# EAGLE schematic schematic (EAGLE 6.6.0)

## Sheet 1 of 5: LEDs Schematic with all the LEDs (Type: WS2812B). There are two seperated data circuits DATA_In_1 and DATA_IN_2 which both have 30 LEDs series-connected.
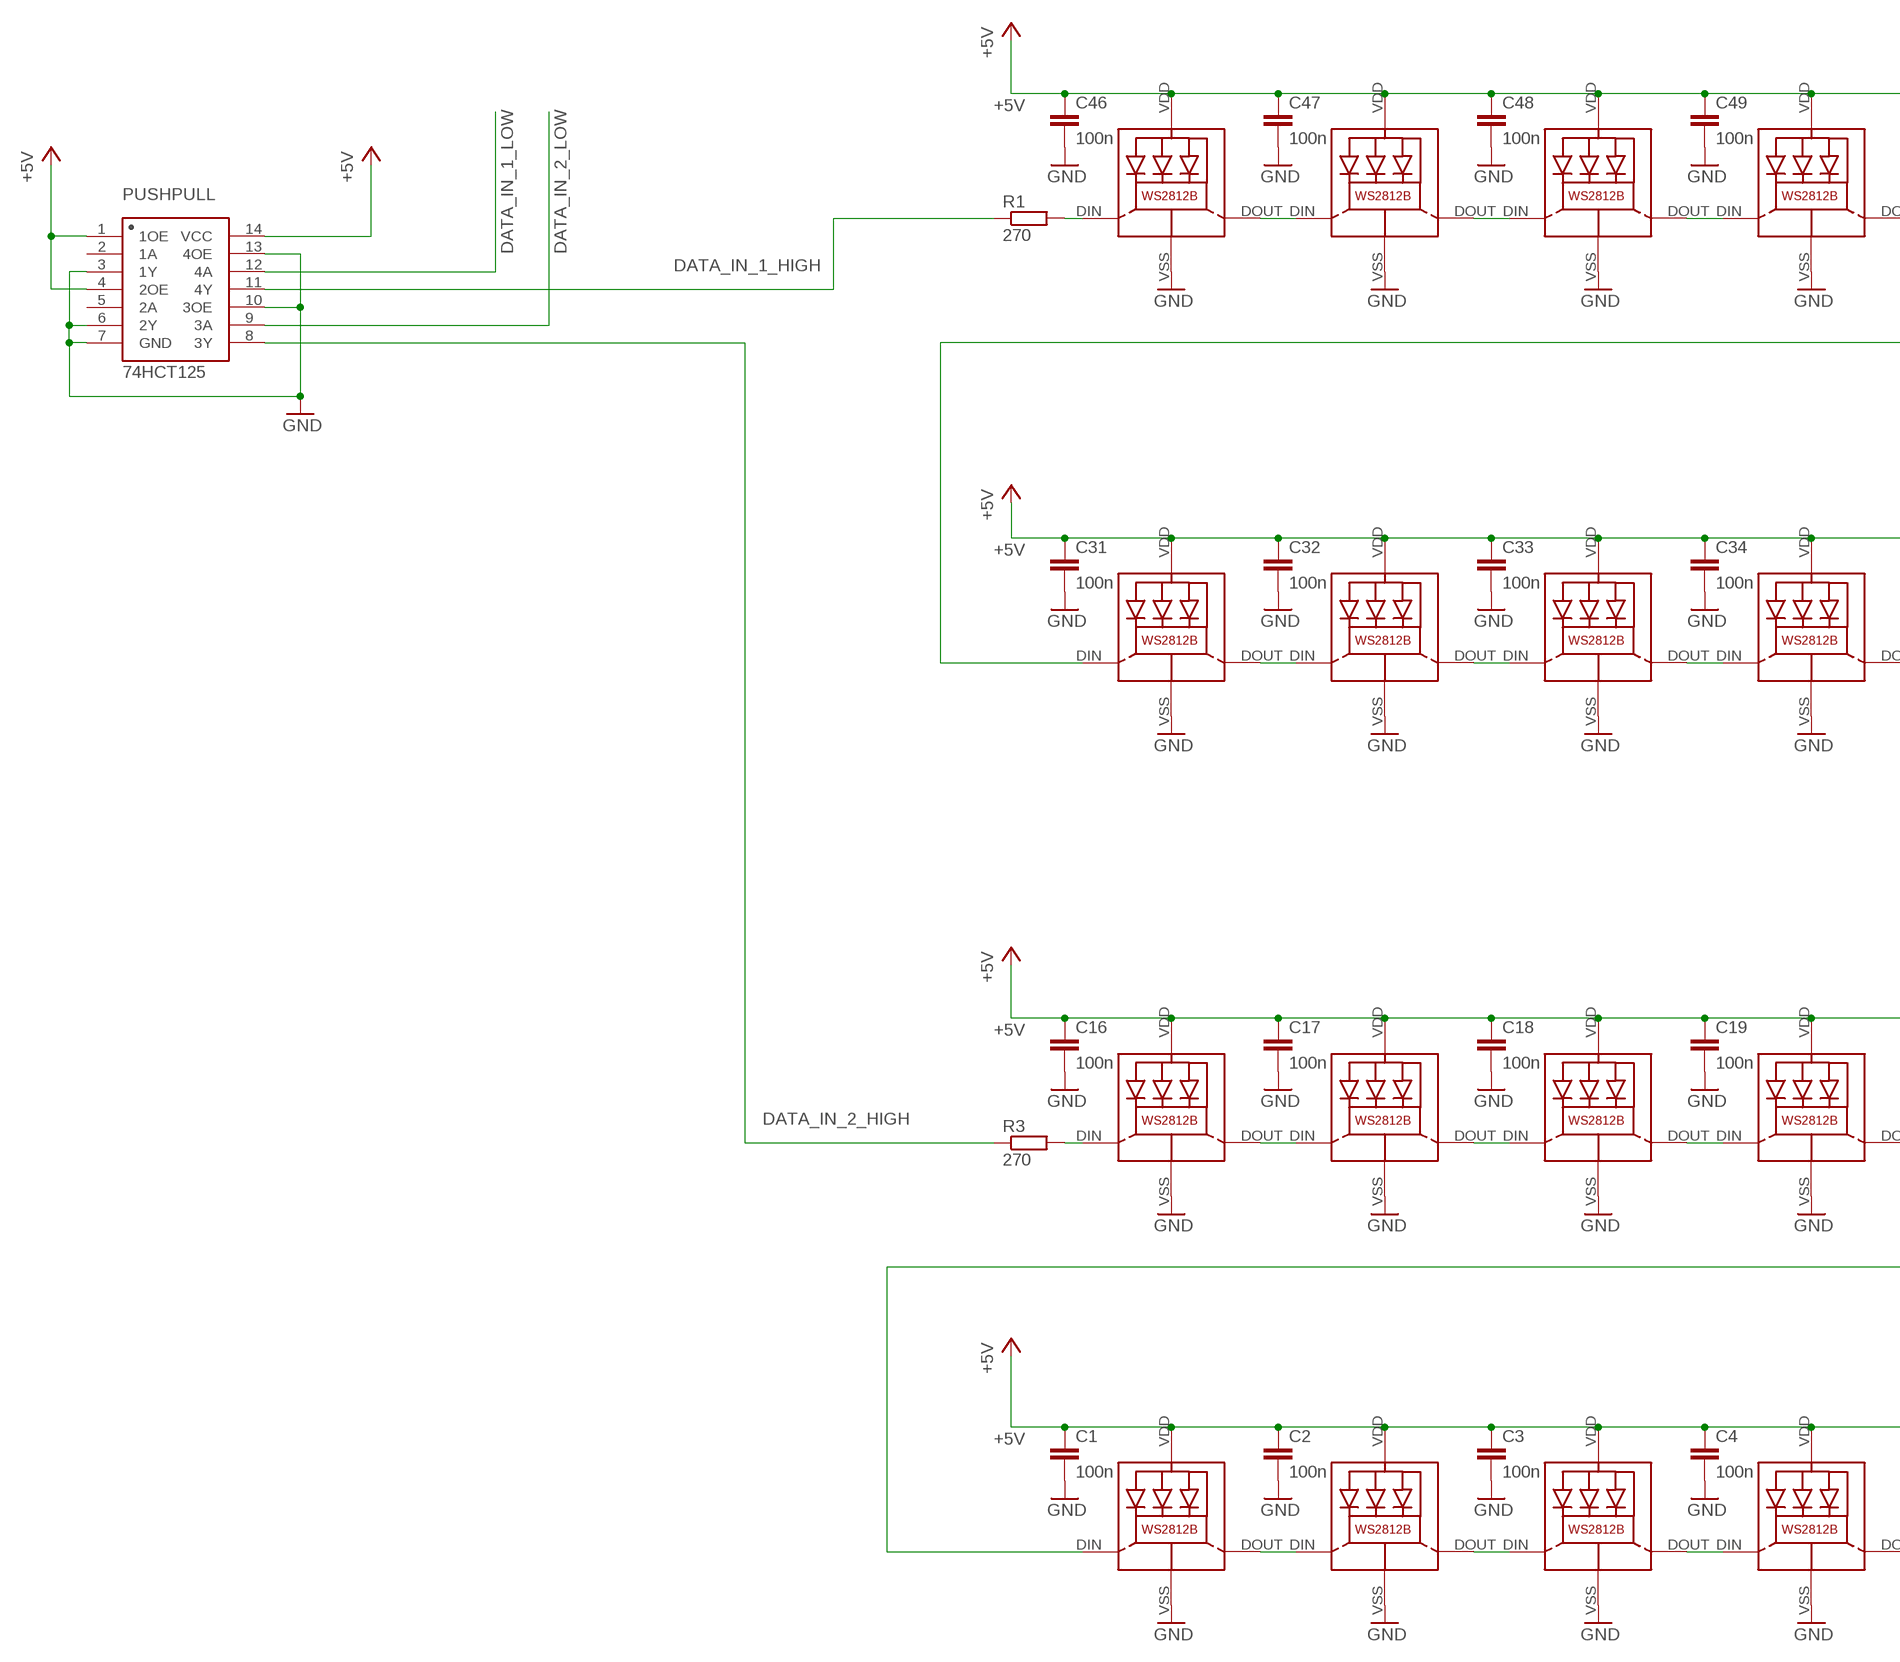
[diagram p0: schematic, sheet 1, part 1 of 2]
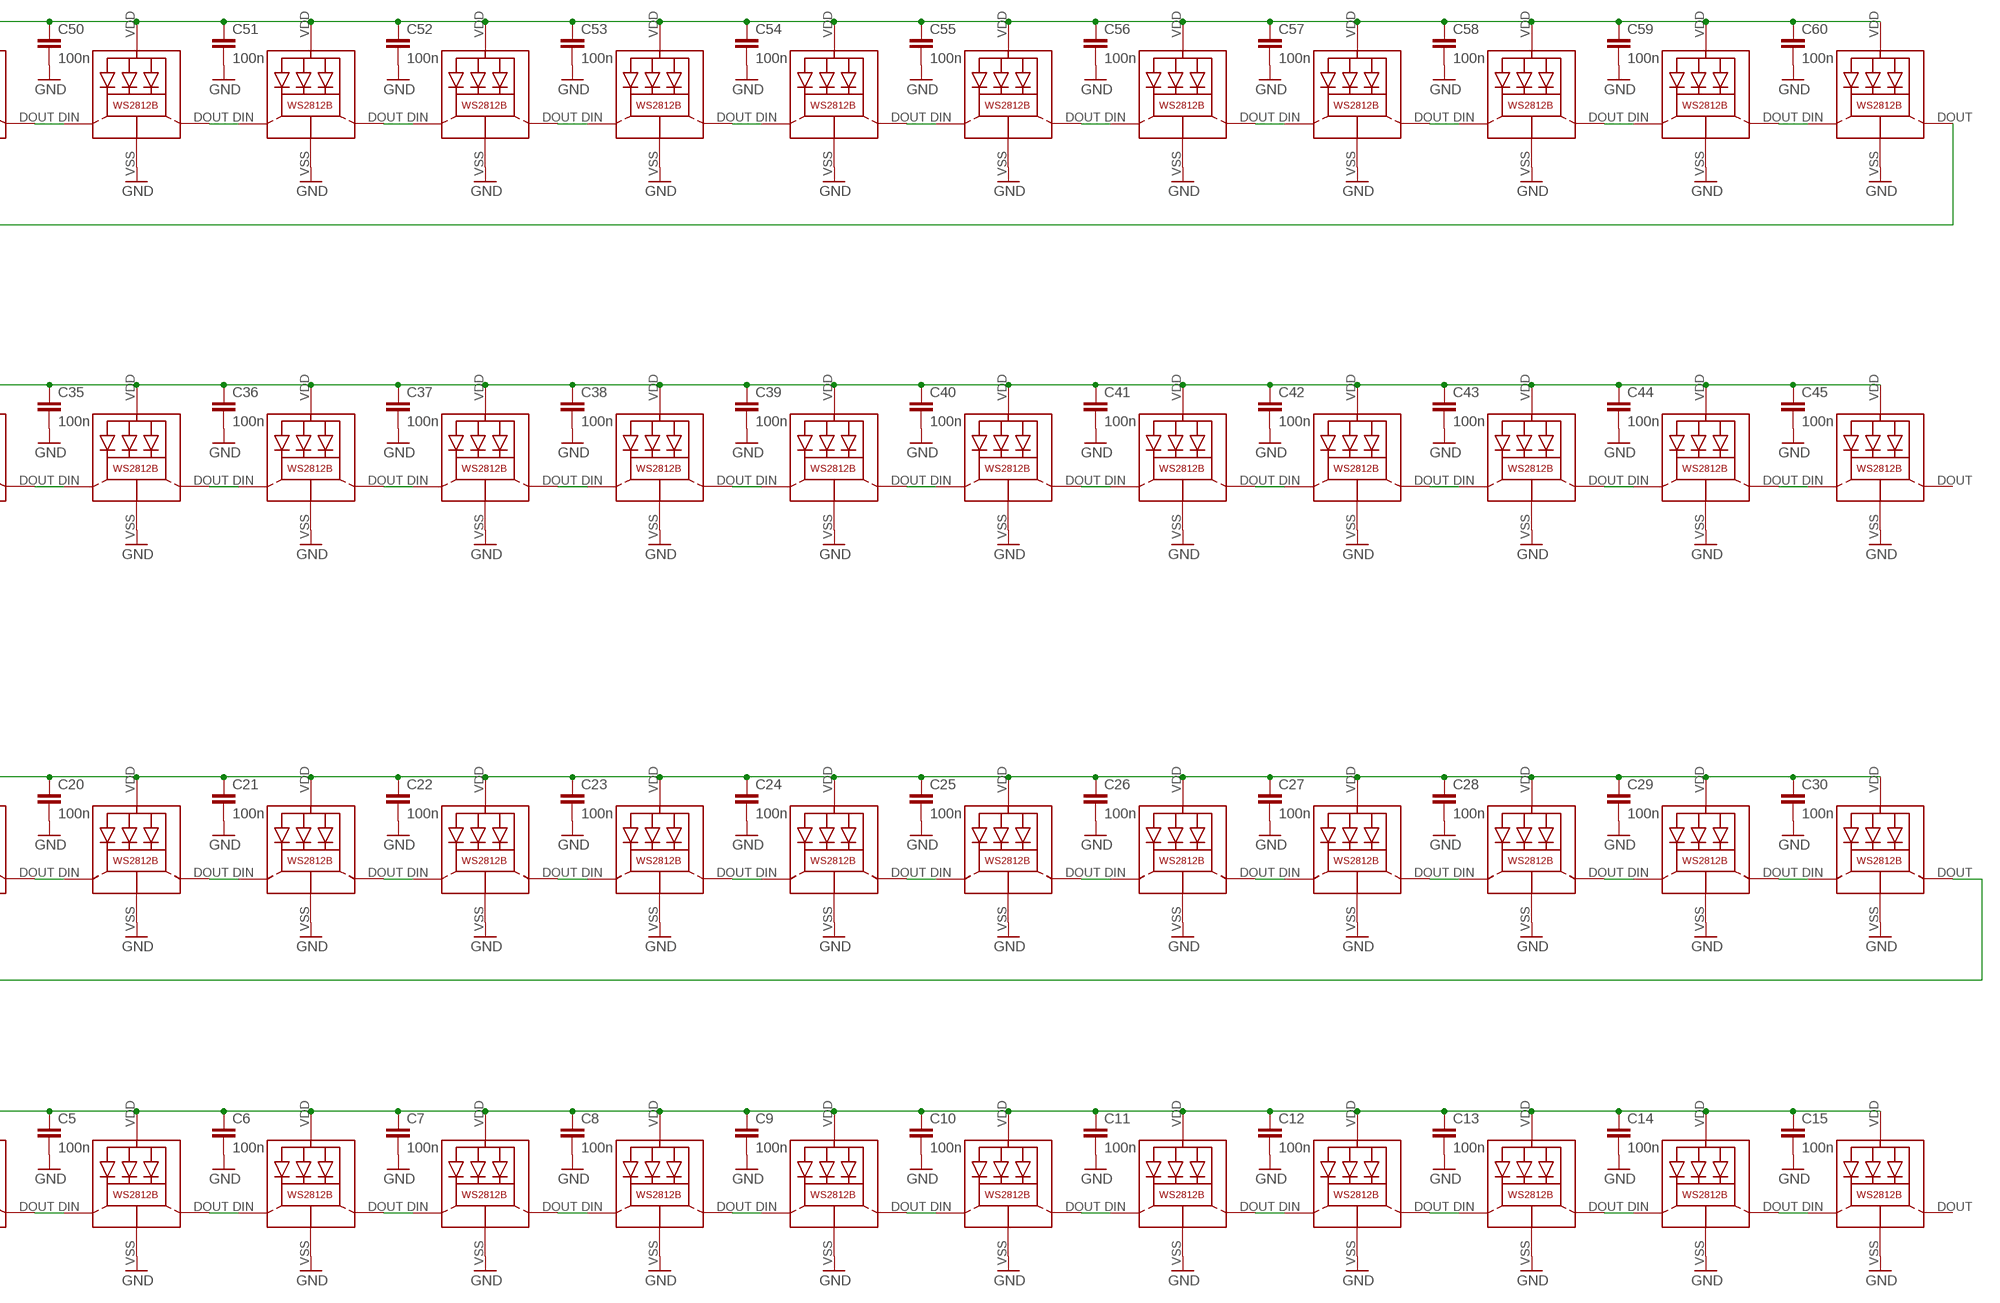
[diagram p1: schematic, sheet 1, part 2 of 2]

### Parts
C1  100n  C-EUC0805  [C0805]
C2  100n  C-EUC0805  [C0805]
C3  100n  C-EUC0805  [C0805]
C4  100n  C-EUC0805  [C0805]
C5  100n  C-EUC0805  [C0805]
C6  100n  C-EUC0805  [C0805]
C7  100n  C-EUC0805  [C0805]
C8  100n  C-EUC0805  [C0805]
C9  100n  C-EUC0805  [C0805]
C10  100n  C-EUC0805  [C0805]
C11  100n  C-EUC0805  [C0805]
C12  100n  C-EUC0805  [C0805]
C13  100n  C-EUC0805  [C0805]
C14  100n  C-EUC0805  [C0805]
C15  100n  C-EUC0805  [C0805]
C16  100n  C-EUC0805  [C0805]
C17  100n  C-EUC0805  [C0805]
C18  100n  C-EUC0805  [C0805]
C19  100n  C-EUC0805  [C0805]
C20  100n  C-EUC0805  [C0805]
C21  100n  C-EUC0805  [C0805]
C22  100n  C-EUC0805  [C0805]
C23  100n  C-EUC0805  [C0805]
C24  100n  C-EUC0805  [C0805]
C25  100n  C-EUC0805  [C0805]
C26  100n  C-EUC0805  [C0805]
C27  100n  C-EUC0805  [C0805]
C28  100n  C-EUC0805  [C0805]
C29  100n  C-EUC0805  [C0805]
C30  100n  C-EUC0805  [C0805]
C31  100n  C-EUC0805  [C0805]
C32  100n  C-EUC0805  [C0805]
C33  100n  C-EUC0805  [C0805]
C34  100n  C-EUC0805  [C0805]
C35  100n  C-EUC0805  [C0805]
C36  100n  C-EUC0805  [C0805]
C37  100n  C-EUC0805  [C0805]
C38  100n  C-EUC0805  [C0805]
C39  100n  C-EUC0805  [C0805]
C40  100n  C-EUC0805  [C0805]
C41  100n  C-EUC0805  [C0805]
C42  100n  C-EUC0805  [C0805]
C43  100n  C-EUC0805  [C0805]
C44  100n  C-EUC0805  [C0805]
C45  100n  C-EUC0805  [C0805]
C46  100n  C-EUC0805  [C0805]
C47  100n  C-EUC0805  [C0805]
C48  100n  C-EUC0805  [C0805]
C49  100n  C-EUC0805  [C0805]
C50  100n  C-EUC0805  [C0805]
C51  100n  C-EUC0805  [C0805]
C52  100n  C-EUC0805  [C0805]
C53  100n  C-EUC0805  [C0805]
C54  100n  C-EUC0805  [C0805]
C55  100n  C-EUC0805  [C0805]
C56  100n  C-EUC0805  [C0805]
C57  100n  C-EUC0805  [C0805]
C58  100n  C-EUC0805  [C0805]
C59  100n  C-EUC0805  [C0805]
C60  100n  C-EUC0805  [C0805]
LED1  WS2812B  [WS2812B]
LED2  WS2812B  [WS2812B]
LED3  WS2812B  [WS2812B]
LED4  WS2812B  [WS2812B]
LED5  WS2812B  [WS2812B]
LED6  WS2812B  [WS2812B]
LED7  WS2812B  [WS2812B]
LED8  WS2812B  [WS2812B]
LED9  WS2812B  [WS2812B]
LED10  WS2812B  [WS2812B]
LED11  WS2812B  [WS2812B]
LED12  WS2812B  [WS2812B]
LED13  WS2812B  [WS2812B]
LED14  WS2812B  [WS2812B]
LED15  WS2812B  [WS2812B]
LED16  WS2812B  [WS2812B]
LED17  WS2812B  [WS2812B]
LED18  WS2812B  [WS2812B]
LED19  WS2812B  [WS2812B]
LED20  WS2812B  [WS2812B]
LED21  WS2812B  [WS2812B]
LED22  WS2812B  [WS2812B]
LED23  WS2812B  [WS2812B]
LED24  WS2812B  [WS2812B]
LED25  WS2812B  [WS2812B]
LED26  WS2812B  [WS2812B]
LED27  WS2812B  [WS2812B]
LED28  WS2812B  [WS2812B]
LED29  WS2812B  [WS2812B]
LED30  WS2812B  [WS2812B]
LED31  WS2812B  [WS2812B]
LED32  WS2812B  [WS2812B]
LED33  WS2812B  [WS2812B]
LED34  WS2812B  [WS2812B]
LED35  WS2812B  [WS2812B]
LED36  WS2812B  [WS2812B]
LED37  WS2812B  [WS2812B]
LED38  WS2812B  [WS2812B]
LED39  WS2812B  [WS2812B]
LED40  WS2812B  [WS2812B]
LED41  WS2812B  [WS2812B]
LED42  WS2812B  [WS2812B]
LED43  WS2812B  [WS2812B]
LED44  WS2812B  [WS2812B]
LED45  WS2812B  [WS2812B]
LED46  WS2812B  [WS2812B]
LED47  WS2812B  [WS2812B]
LED48  WS2812B  [WS2812B]
LED49  WS2812B  [WS2812B]
LED50  WS2812B  [WS2812B]
LED51  WS2812B  [WS2812B]
LED52  WS2812B  [WS2812B]
LED53  WS2812B  [WS2812B]
LED54  WS2812B  [WS2812B]
LED55  WS2812B  [WS2812B]
LED56  WS2812B  [WS2812B]
LED57  WS2812B  [WS2812B]
LED58  WS2812B  [WS2812B]
LED59  WS2812B  [WS2812B]
LED60  WS2812B  [WS2812B]
PUSHPULL  74HCT125  [SO-14DW]
R1  270  R-EU_R0805  [R0805]
R3  270  R-EU_R0805  [R0805]

### Nets
+5V: C1.1 C2.1 C3.1 C4.1 C5.1 C6.1 C7.1 C8.1 C9.1 C10.1 C11.1 C12.1 C13.1 C14.1 C15.1 C16.1 C17.1 C18.1 C19.1 C20.1 C21.1 C22.1 C23.1 C24.1 C25.1 C26.1 C27.1 C28.1 C29.1 C30.1 C31.1 C32.1 C33.1 C34.1 C35.1 C36.1 C37.1 C38.1 C39.1 C40.1 C41.1 C42.1 C43.1 C44.1 C45.1 C46.1 C47.1 C48.1 C49.1 C50.1 C51.1 C52.1 C53.1 C54.1 C55.1 C56.1 C57.1 C58.1 C59.1 C60.1 LED1.VDD LED2.VDD LED3.VDD LED4.VDD LED5.VDD LED6.VDD LED7.VDD LED8.VDD LED9.VDD LED10.VDD LED11.VDD LED12.VDD LED13.VDD LED14.VDD LED15.VDD LED16.VDD LED17.VDD LED18.VDD LED19.VDD LED20.VDD LED21.VDD LED22.VDD LED23.VDD LED24.VDD LED25.VDD LED26.VDD LED27.VDD LED28.VDD LED29.VDD LED30.VDD LED31.VDD LED32.VDD LED33.VDD LED34.VDD LED35.VDD LED36.VDD LED37.VDD LED38.VDD LED39.VDD LED40.VDD LED41.VDD LED42.VDD LED43.VDD LED44.VDD LED45.VDD LED46.VDD LED47.VDD LED48.VDD LED49.VDD LED50.VDD LED51.VDD LED52.VDD LED53.VDD LED54.VDD LED55.VDD LED56.VDD LED57.VDD LED58.VDD LED59.VDD LED60.VDD PUSHPULL.1(1OE) PUSHPULL.4(2OE) PUSHPULL.14(VCC) ; also sheet 2
DATA_IN_1_HIGH: PUSHPULL.11(4Y) R1.1
DATA_IN_1_LOW: PUSHPULL.12(4A) ; also sheet 3
DATA_IN_2_HIGH: PUSHPULL.8(3Y) R3.1
DATA_IN_2_LOW: PUSHPULL.9(3A) ; also sheet 3
GND: C1.2 C2.2 C3.2 C4.2 C5.2 C6.2 C7.2 C8.2 C9.2 C10.2 C11.2 C12.2 C13.2 C14.2 C15.2 C16.2 C17.2 C18.2 C19.2 C20.2 C21.2 C22.2 C23.2 C24.2 C25.2 C26.2 C27.2 C28.2 C29.2 C30.2 C31.2 C32.2 C33.2 C34.2 C35.2 C36.2 C37.2 C38.2 C39.2 C40.2 C41.2 C42.2 C43.2 C44.2 C45.2 C46.2 C47.2 C48.2 C49.2 C50.2 C51.2 C52.2 C53.2 C54.2 C55.2 C56.2 C57.2 C58.2 C59.2 C60.2 LED1.VSS(GND) LED2.VSS(GND) LED3.VSS(GND) LED4.VSS(GND) LED5.VSS(GND) LED6.VSS(GND) LED7.VSS(GND) LED8.VSS(GND) LED9.VSS(GND) LED10.VSS(GND) LED11.VSS(GND) LED12.VSS(GND) LED13.VSS(GND) LED14.VSS(GND) LED15.VSS(GND) LED16.VSS(GND) LED17.VSS(GND) LED18.VSS(GND) LED19.VSS(GND) LED20.VSS(GND) LED21.VSS(GND) LED22.VSS(GND) LED23.VSS(GND) LED24.VSS(GND) LED25.VSS(GND) LED26.VSS(GND) LED27.VSS(GND) LED28.VSS(GND) LED29.VSS(GND) LED30.VSS(GND) LED31.VSS(GND) LED32.VSS(GND) LED33.VSS(GND) LED34.VSS(GND) LED35.VSS(GND) LED36.VSS(GND) LED37.VSS(GND) LED38.VSS(GND) LED39.VSS(GND) LED40.VSS(GND) LED41.VSS(GND) LED42.VSS(GND) LED43.VSS(GND) LED44.VSS(GND) LED45.VSS(GND) LED46.VSS(GND) LED47.VSS(GND) LED48.VSS(GND) LED49.VSS(GND) LED50.VSS(GND) LED51.VSS(GND) LED52.VSS(GND) LED53.VSS(GND) LED54.VSS(GND) LED55.VSS(GND) LED56.VSS(GND) LED57.VSS(GND) LED58.VSS(GND) LED59.VSS(GND) LED60.VSS(GND) PUSHPULL.3(1Y) PUSHPULL.6(2Y) PUSHPULL.7(GND) PUSHPULL.10(3OE) PUSHPULL.13(4OE) ; also sheet 2,3,4
N$1: LED46.DIN(DI) R1.2
N$2: LED46.DOUT(DO) LED47.DIN(DI)
N$3: LED47.DOUT(DO) LED48.DIN(DI)
N$4: LED48.DOUT(DO) LED49.DIN(DI)
N$5: LED49.DOUT(DO) LED50.DIN(DI)
N$6: LED50.DOUT(DO) LED51.DIN(DI)
N$7: LED51.DOUT(DO) LED52.DIN(DI)
N$8: LED52.DOUT(DO) LED53.DIN(DI)
N$9: LED53.DOUT(DO) LED54.DIN(DI)
N$10: LED54.DOUT(DO) LED55.DIN(DI)
N$11: LED55.DOUT(DO) LED56.DIN(DI)
N$12: LED56.DOUT(DO) LED57.DIN(DI)
N$13: LED57.DOUT(DO) LED58.DIN(DI)
N$14: LED58.DOUT(DO) LED59.DIN(DI)
N$15: LED59.DOUT(DO) LED60.DIN(DI)
N$16: LED31.DIN(DI) LED60.DOUT(DO)
N$17: LED1.DIN(DI) LED30.DOUT(DO)
N$18: LED1.DOUT(DO) LED2.DIN(DI)
N$19: LED2.DOUT(DO) LED3.DIN(DI)
N$20: LED3.DOUT(DO) LED4.DIN(DI)
N$21: LED4.DOUT(DO) LED5.DIN(DI)
N$22: LED5.DOUT(DO) LED6.DIN(DI)
N$23: LED6.DOUT(DO) LED7.DIN(DI)
N$24: LED7.DOUT(DO) LED8.DIN(DI)
N$25: LED8.DOUT(DO) LED9.DIN(DI)
N$26: LED9.DOUT(DO) LED10.DIN(DI)
N$27: LED10.DOUT(DO) LED11.DIN(DI)
N$28: LED11.DOUT(DO) LED12.DIN(DI)
N$29: LED12.DOUT(DO) LED13.DIN(DI)
N$30: LED13.DOUT(DO) LED14.DIN(DI)
N$31: LED14.DOUT(DO) LED15.DIN(DI)
N$32: LED16.DIN(DI) R3.2
N$33: LED16.DOUT(DO) LED17.DIN(DI)
N$34: LED17.DOUT(DO) LED18.DIN(DI)
N$35: LED18.DOUT(DO) LED19.DIN(DI)
N$36: LED19.DOUT(DO) LED20.DIN(DI)
N$37: LED20.DOUT(DO) LED21.DIN(DI)
N$38: LED21.DOUT(DO) LED22.DIN(DI)
N$39: LED22.DOUT(DO) LED23.DIN(DI)
N$40: LED23.DOUT(DO) LED24.DIN(DI)
N$41: LED24.DOUT(DO) LED25.DIN(DI)
N$42: LED25.DOUT(DO) LED26.DIN(DI)
N$43: LED26.DOUT(DO) LED27.DIN(DI)
N$44: LED27.DOUT(DO) LED28.DIN(DI)
N$45: LED28.DOUT(DO) LED29.DIN(DI)
N$46: LED29.DOUT(DO) LED30.DIN(DI)
N$48: LED31.DOUT(DO) LED32.DIN(DI)
N$49: LED32.DOUT(DO) LED33.DIN(DI)
N$50: LED33.DOUT(DO) LED34.DIN(DI)
N$51: LED34.DOUT(DO) LED35.DIN(DI)
N$52: LED35.DOUT(DO) LED36.DIN(DI)
N$53: LED36.DOUT(DO) LED37.DIN(DI)
N$54: LED37.DOUT(DO) LED38.DIN(DI)
N$55: LED38.DOUT(DO) LED39.DIN(DI)
N$56: LED39.DOUT(DO) LED40.DIN(DI)
N$57: LED40.DOUT(DO) LED41.DIN(DI)
N$58: LED41.DOUT(DO) LED42.DIN(DI)
N$59: LED42.DOUT(DO) LED43.DIN(DI)
N$60: LED43.DOUT(DO) LED44.DIN(DI)
N$61: LED44.DOUT(DO) LED45.DIN(DI)
Unconnected: LED15.DOUT(DO) LED45.DOUT(DO) PUSHPULL.2(1A) PUSHPULL.5(2A)

## Sheet 2 of 5: Power Management Power Management with LTC4412 for auto selection of USB supply or external power supply. LTC4412 controls two mosfets. Diode for overvoltage protection of the USB port.
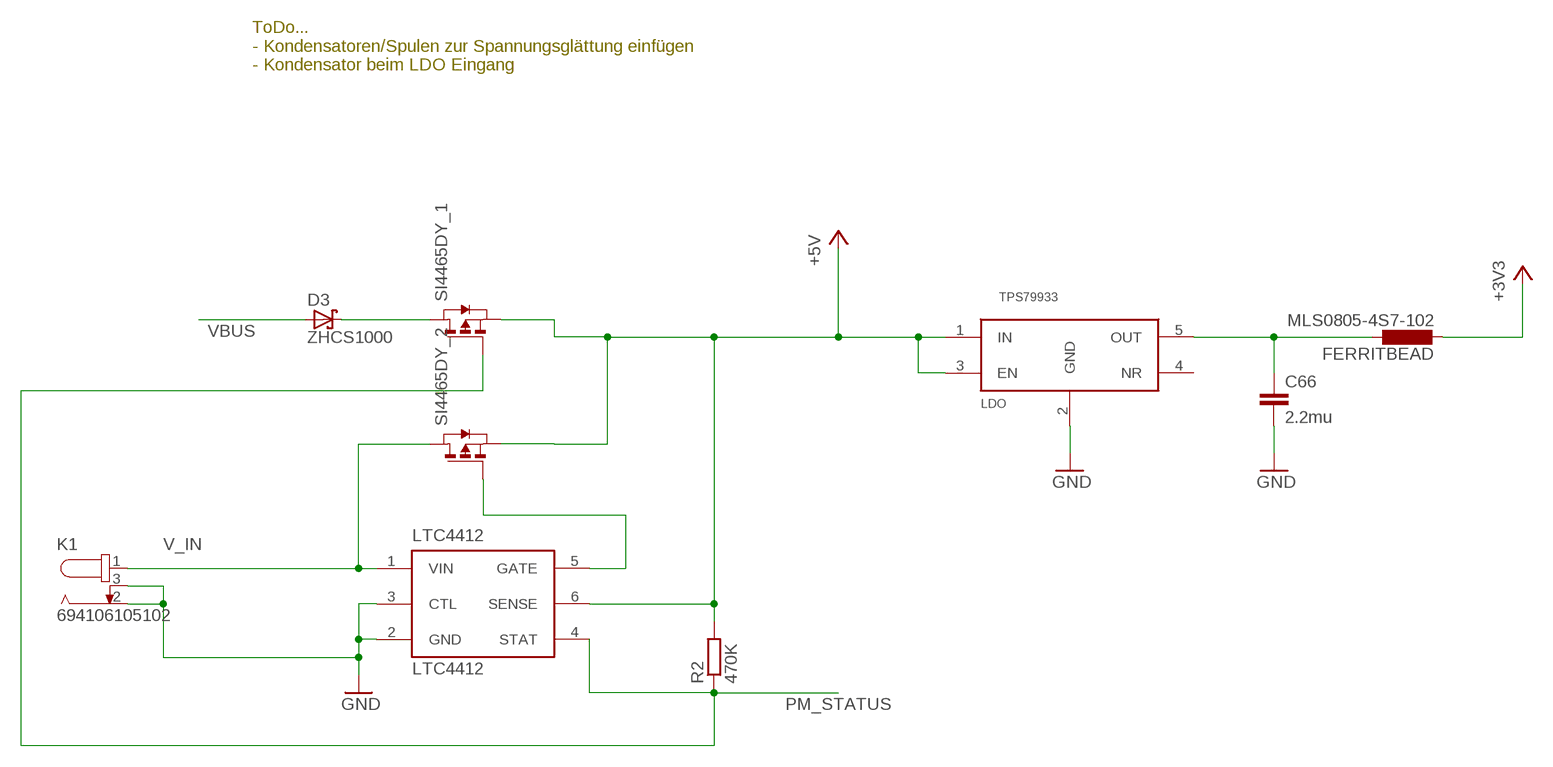
[diagram p2: schematic, sheet 2]

### Parts
C66  2.2mu  C-EUC0805  [C0805]
D3  ZHCS1000  [SOT23]
FERRITBEAD  MLS0805-4S7-102  [M0805]
K1  694106105102  [694106105102]
LDO  TPS79933  [SOT23-DBV]
LTC4412  LTC4412  [SOT23-6L]
R2  470K  R-EU_R0805  [R0805]
SI4465DY_1  PMOSSOT223SO8  [SO08]
SI4465DY_2  PMOSSOT223SO8  [SO08]

### Nets
+3V3: FERRITBEAD.2 ; also sheet 3
+5V: LDO.1(IN) LDO.3(EN) LTC4412.6(SENSE) R2.2 SI4465DY_1.1(S) SI4465DY_1.2(S) SI4465DY_1.3(S) SI4465DY_2.1(S) SI4465DY_2.2(S) SI4465DY_2.3(S) ; also sheet 1
GND: C66.2 K1.2 K1.3 LDO.2(GND) LTC4412.2(GND) LTC4412.3(CTL) ; also sheet 1,3,4
N$62: C66.1 FERRITBEAD.1 LDO.5(OUT)
N$63: LTC4412.5(GATE) SI4465DY_2.4(G)
N$69: D3.1(C) SI4465DY_1.5(D) SI4465DY_1.6(D) SI4465DY_1.7(D) SI4465DY_1.8(D)
PM_STATUS: LTC4412.4(STAT) R2.1 SI4465DY_1.4(G) ; also sheet 3
V_IN: K1.1 LTC4412.1(VIN) SI4465DY_2.5(D) SI4465DY_2.6(D) SI4465DY_2.7(D) SI4465DY_2.8(D)
VBUS: D3.3(A) ; also sheet 4
Unconnected: LDO.4(NR)

### Notes on the sheet
- ToDo...
  - Kondensatoren/Spulen zur Spannungsglättung einfügen
  - Kondensator beim LDO Eingang

## Sheet 3 of 5: MCU A STM32745VE is used as a microcontroller
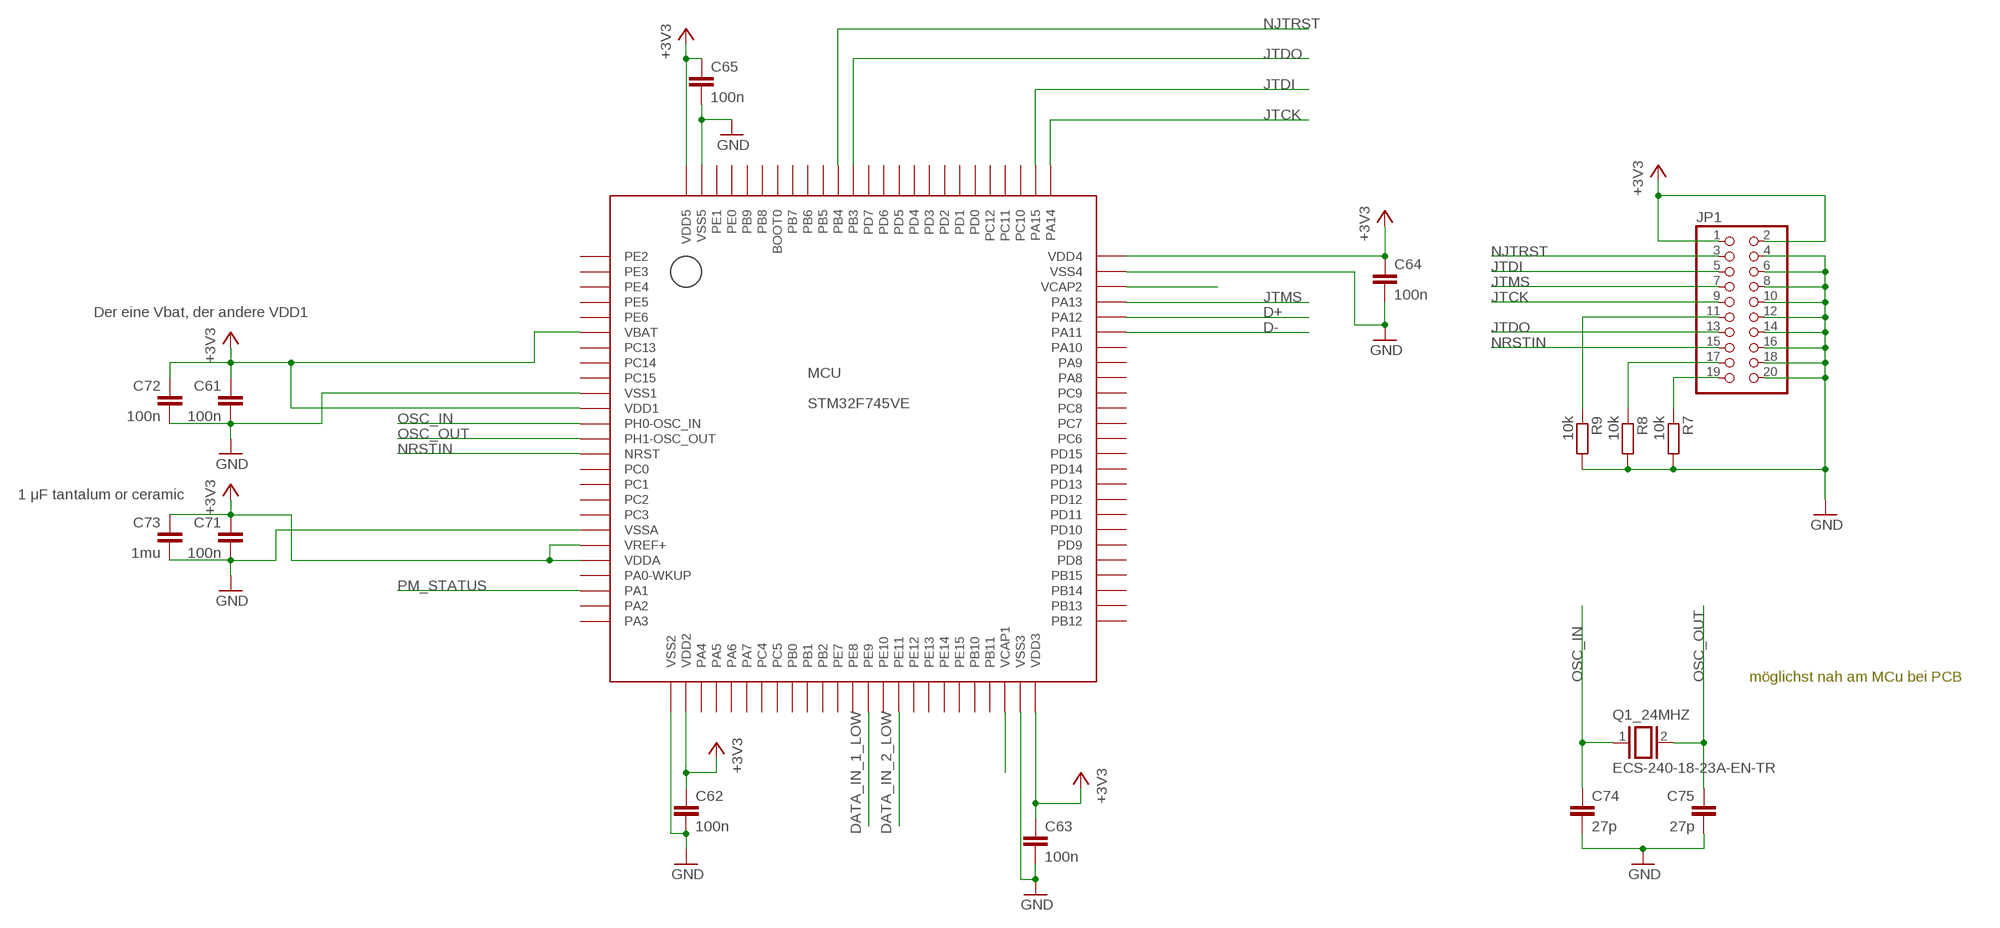
[diagram p3: schematic, sheet 3]

### Parts
C61  100n  C-EUC0805  [C0805]
C62  100n  C-EUC0805  [C0805]
C63  100n  C-EUC0805  [C0805]
C64  100n  C-EUC0805  [C0805]
C65  100n  C-EUC0805  [C0805]
C71  100n  C-EUC0805  [C0805]
C72  100n  C-EUC0805  [C0805]
C73  1mu  C-EUC0805  [C0805]
C74  27p  C-EUC0805  [C0805]
C75  27p  C-EUC0805  [C0805]
JP1  PINHD-2X10  [2X10]
MCU  STM32F745VE  [LQFP100]
Q1_24MHZ  ECS-240-18-23A-EN-TR  ECX64A  [ESC64A]
R7  10k  R-EU_R0805  [R0805]
R8  10k  R-EU_R0805  [R0805]
R9  10k  R-EU_R0805  [R0805]

### Nets
+3V3: C61.1 C62.1 C63.1 C64.1 C65.1 C71.1 C72.1 C73.1 JP1.1 JP1.2 MCU.6(VBAT) MCU.11(VDD1) MCU.20(VREF+) MCU.21(VDDA) MCU.27(VDD2) MCU.50(VDD3) MCU.75(VDD4) MCU.100(VDD5) ; also sheet 2
D+: MCU.71(PA12) ; also sheet 4
D-: MCU.70(PA11) ; also sheet 4
DATA_IN_1_LOW: MCU.39(PE9) ; also sheet 1
DATA_IN_2_LOW: MCU.41(PE11) ; also sheet 1
GND: C61.2 C62.2 C63.2 C64.2 C65.2 C71.2 C72.2 C73.2 C74.2 C75.2 JP1.4 JP1.6 JP1.8 JP1.10 JP1.12 JP1.14 JP1.16 JP1.18 JP1.20 MCU.10(VSS1) MCU.19(VSSA) MCU.26(VSS2) MCU.49(VSS3) MCU.74(VSS4) MCU.99(VSS5) R7.2 R8.2 R9.2 ; also sheet 1,2,4
JTCK: JP1.9 MCU.76(PA14)
JTDI: JP1.5 MCU.77(PA15)
JTDO: JP1.13 MCU.89(PB3)
JTMS: JP1.7 MCU.72(PA13)
N$71: MCU.48(VCAP1)
N$72: MCU.73(VCAP2)
N$76: JP1.19 R7.1
N$77: JP1.17 R8.1
N$78: JP1.11 R9.1
NJTRST: JP1.3 MCU.90(PB4)
NRSTIN: JP1.15 MCU.14(NRST)
OSC_IN: C74.1 MCU.12(PH0-OSC_IN) Q1_24MHZ.1
OSC_OUT: C75.1 MCU.13(PH1-OSC_OUT) Q1_24MHZ.2
PM_STATUS: MCU.23(PA1) ; also sheet 2
Unconnected: MCU.1(PE2) MCU.2(PE3) MCU.3(PE4) MCU.4(PE5) MCU.5(PE6) MCU.7(PC13) MCU.8(PC14) MCU.9(PC15) MCU.15(PC0) MCU.16(PC1) MCU.17(PC2) MCU.18(PC3) MCU.22(PA0-WKUP) MCU.24(PA2) MCU.25(PA3) MCU.28(PA4) MCU.29(PA5) MCU.30(PA6) MCU.31(PA7) MCU.32(PC4) MCU.33(PC5) MCU.34(PB0) MCU.35(PB1) MCU.36(PB2) MCU.37(PE7) MCU.38(PE8) MCU.40(PE10) MCU.42(PE12) MCU.43(PE13) MCU.44(PE14) MCU.45(PE15) MCU.46(PB10) MCU.47(PB11) MCU.51(PB12) MCU.52(PB13) MCU.53(PB14) MCU.54(PB15) MCU.55(PD8) MCU.56(PD9) MCU.57(PD10) MCU.58(PD11) MCU.59(PD12) MCU.60(PD13) MCU.61(PD14) MCU.62(PD15) MCU.63(PC6) MCU.64(PC7) MCU.65(PC8) MCU.66(PC9) MCU.67(PA8) MCU.68(PA9) MCU.69(PA10) MCU.78(PC10) MCU.79(PC11) MCU.80(PC12) MCU.81(PD0) MCU.82(PD1) MCU.83(PD2) MCU.84(PD3) MCU.85(PD4) MCU.86(PD5) MCU.87(PD6) MCU.88(PD7) MCU.91(PB5) MCU.92(PB6) MCU.93(PB7) MCU.94(BOOT0) MCU.95(PB8) MCU.96(PB9) MCU.97(PE0) MCU.98(PE1)

### Notes on the sheet
- Der eine Vbat, der andere VDD1
- 1 μF tantalum or ceramic
- möglichst nah am MCu bei PCB

## Sheet 4 of 5: USB USB-Connection
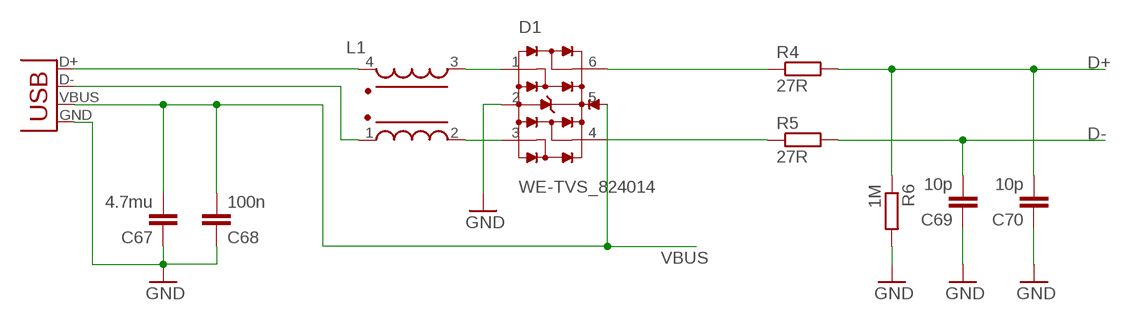
[diagram p4: schematic, sheet 4]

### Parts
C67  4.7mu  C-EUC0805  [C0805]
C68  100n  C-EUC0805  [C0805]
C69  10p  C-EUC0805  [C0805]
C70  10p  C-EUC0805  [C0805]
D1  WE-TVS_824014  [WE-TVS_SOT23-6L]
L1  WE-CNSW_0805  [WE-CNSW_0805]
R4  27R  R-EU_R0805  [R0805]
R5  27R  R-EU_R0805  [R0805]
R6  1M  R-EU_R0805  [R0805]
X1  USBSMD  [USB-MINIB]

### Nets
D+: C70.2 R4.2 R6.1 ; also sheet 3
D-: C69.2 R5.2 ; also sheet 3
GND: C67.1 C68.1 C69.1 C70.1 D1.2(GND) R6.2 X1.GND ; also sheet 1,2,3
N$47: L1.4 X1.D+
N$64: L1.1 X1.D-
N$65: D1.1 L1.3
N$66: D1.3 L1.2
N$67: D1.6 R4.1
N$68: D1.4 R5.1
VBUS: C67.2 C68.2 D1.5(VDD) X1.VBUS ; also sheet 2

## Sheet 5 of 5
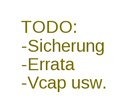
[diagram p5: schematic, sheet 5]

### Notes on the sheet
- TODO:
  -Sicherung
  -Errata
  -Vcap usw.

## Library data of the parts
C1-C75 = rcl:C-EU: CAPACITOR, European symbol
D1 = Wurth_Elektronik_EMC_COMPONENTS_rev16c:WE-TVS_824014: TVS Diode Super Speed Series Characteristics Operating temperature: –55 ºC to +85 °C for 824 014 x; –40 ºC to +85 °C for 824 016 46 Low clamping voltage Very low capacitance Rail to Rail protection Epoxy flame resistant UL94 V-0 RoHS, REACH and free of halogens Applications Super Speed data lines HDMI 1.3/1.4, DVI DisplayPort USB 3.0 SuperSpeed SATA GBit LAN ESD protection in accordance with EN 61000-4-2 – 8 kV contact discharge – 15 kV air discharge <http://katalog.we-online.de/media/images/eisos/VarTVS_highspeed_pf2.jpg.jpg> Details see: http://katalog.we-online.de/en/pbs/WE-TVS_High_Speed/24014? Updated by Dan Xu 2014-07-11 2014 (C) Wurth Elektronik
D3 = ownLib:ZHCS1000: Silicon Schottky Diodes General-purpose diode for high-speed switching
FERRITBEAD = MLS0805:MLS0805-4S7-102
JP1 = pinhead:PINHD-2X10: PIN HEADER
K1 = Wurth_Elektronik_Electromechanic_DC_Power_Jack_Connectors_rev15c:694106105102: WR-DC_DC Power Jack_Right Angled_SMT Center Pin Ø2.0_Plug ID Ø2.05_Plug OD Ø5.5_with Peg ;=>Code : Con_WR-DC_SMT_694106105102_694106105102 <http://katalog.we-online.de/media/images/eican/Con_WR-DC_SMT_694106105102_pf2.jpg> Details see: http://katalog.we-online.de/em/datasheet/6941xx105102.pdf Created 2014-10-08, Karrer Zheng 2014 (C) Wurth Elektronik
L1 = Wurth_Elektronik_EMC_COMPONENTS_rev16c:WE-CNSW: WE-CNSW SMD Common Mode Line Filter Characteristics High common mode noise suppression at high frequencies Small influence on high speed signals through winding symmetry Operating temperature: –40 ºC to +125 ºC (Size 0805/1206/1812); –40 ºC to +105 ºC (Size 0603) Applications USB 2.0 IEEE 1394 (Firewire) LVDS High Speed Data Lines LAN <http://katalog.we-online.de/media/images/eisos/IndCNSW_pf2.jpg> Details see: http://katalog.we-online.de/en/pbs/WE-CNSW Updated by Dan Xu 2014-06-30 2014 (C) Wurth Elektronik
LDO = TPS79933:TPS79933
LED1-LED60 = WS2812B:WS2812B: Features and Benefits  * Intelligent reverse connect protection, the power supply reverse connection does not damage the IC. * The control circuit and the LED share the only power source. Control circuit and RGB chip are integrated in a package of 5050 components, form a complete control of pixel point.  * Built-in signal reshaping circuit, after wave reshaping to the next driver, ensure wave-form distortion not accumulate.  * Built-in electric reset circuit and power lost reset circuit.  * Each pixel of the three primary color can achieve 256 brightness display, completed 16777216 color full color display, and scan frequency not less than 400Hz/s.  * Cascading port transmission signal by single line.  * Any two point the distance more than 5m transmission signal without any increase circuit.  * When the refresh rate is 30fps, cascade number are not less than1024 points.  * Send data at speeds of 800Kbps.  *The color of the light were highly consistent, cost-effective. Applications  Full-color module, Full color soft lights a lamp strip. LED decorative lighting, Indoor/outdoor LED video irregular screen. General description WS2812B is a intelligent control LED light source that the control circuit and RGB chip are integrated in a package of 5050 components. It internal include intelligent digital port data latch and signal reshaping amplification drive circuit. Also include a precision internal oscillator and a 12V voltage programmable constant curre-nt control part, effectively ensuring the pixel point light color height consistent. The data transfer protocol use single NZR communication mode. After the pixel power-on reset, the DIN port receive data from controller, the first pixel collect initial 24bit data then sent to the internal data latch, the other data which reshaping by the internal signal reshaping amplification circuit sent to the next cascade pixel through the DO port. After transmission for each pixel,the signal to reduce 24bit. pixel adopt auto reshaping transmit technology, making the pixel cascade number is not limited the signal transmission, only depend on the speed of signal transmission. LED with low driving voltage, environmental protection and energy saving, high brightness, scattering angle is large, good consistency, low power, long life and other advantages. The control chip integrated in LED above becoming more simple circuit, small volume, convenient installation. Absolute Maximum Ratings Power supply voltage: VDD +3.5V..+5.3V Input voltage: VI -0.5V..VDD+0.5V based on WS2812 from https://github.com/adafruit/Adafruit-Eagle-Library
LTC4412 = LTC4412:LTC4412
MCU = STM32F745VE_LQFP100:STM32F745VE
PUSHPULL = 74HCT125:74HCT125
Q1_24MHZ = Crystal:ECX64A: CRYSTAL
R1-R9 = rcl:R-EU_: RESISTOR, European symbol
SI4465DY_1 SI4465DY_2 = ownLib:PMOSSOT223: MOS FET
X1 = usb:USB: USB Connectors USB-B-PTH is fully proven SKU : PRT-00139 USB-miniB is fully proven SKU : PRT-00587 USB-A-PCB is untested. USB-A-H is throughly reviewed, but untested. Spark Fun Electronics SKU : PRT-00437 USB-B-SMT is throughly reviewed, but untested. Needs silkscreen touching up. USB-A-S has not been used/tested USB-MB-H has not been used/tested